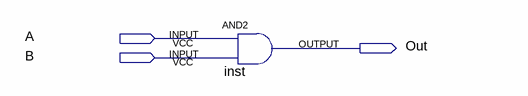
[diagram p0: schematic sheet]
// Quartus schematic and2.bdf as structural Verilog: 1 symbols, 3 pins
module and2 (
  input  A,
  input  B,
  output Out
);

  and inst (Out, A, B);
endmodule
